# EAGLE design Pitch Converter (EAGLE 6.5.0)
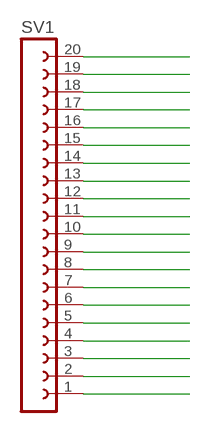
[diagram p0: schematic, sheet 1]

## Parts
SV1  FE20-1  [FE20]

## Nets
N$1: SV1.20
N$8: SV1.19
N$9: SV1.18
N$10: SV1.17
N$11: SV1.16
N$12: SV1.15
N$13: SV1.14
N$14: SV1.13
N$15: SV1.12
N$16: SV1.11
N$17: SV1.10
N$18: SV1.9
N$19: SV1.8
N$20: SV1.7
N$21: SV1.6
N$22: SV1.5
N$23: SV1.4
N$24: SV1.3
N$25: SV1.2
N$26: SV1.1

## Library data of the parts
SV1 = con-lsta:FE20-1: FEMALE HEADER; OC_FARNELL: unknown; OC_NEWARK: unknown

## Board
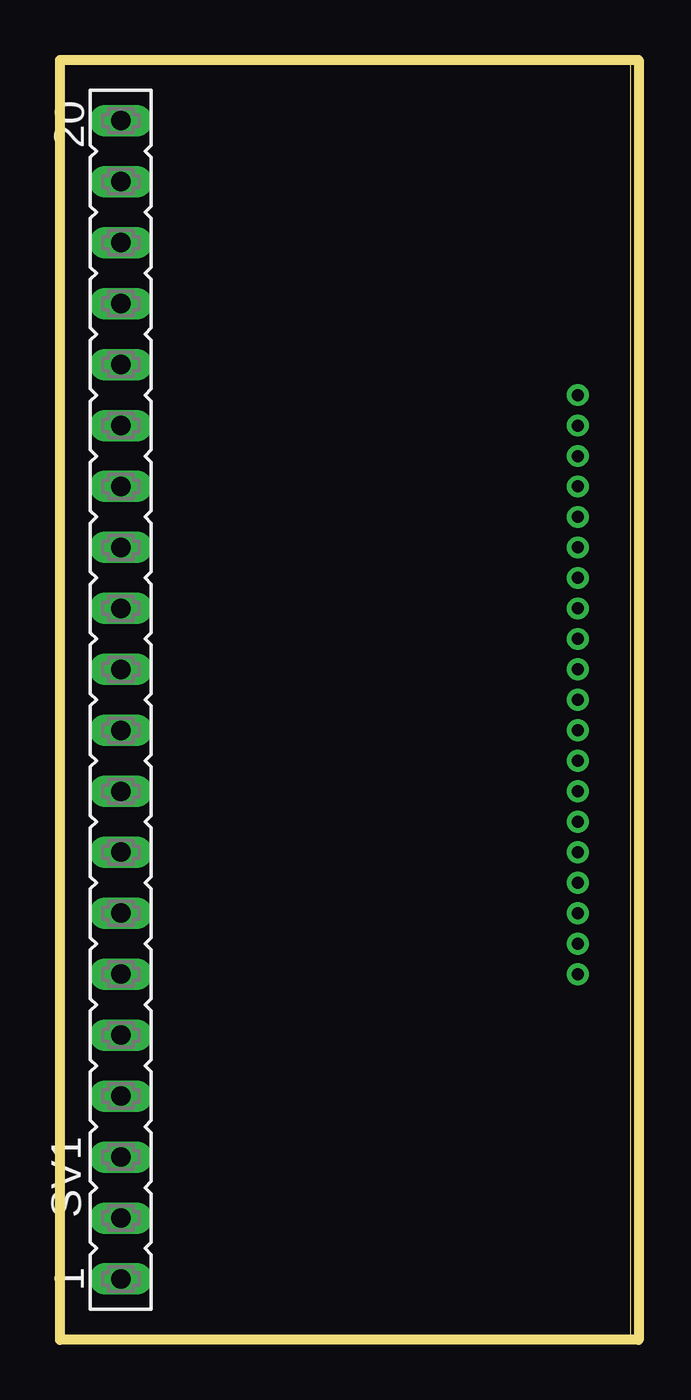
[diagram p1: board, top side]
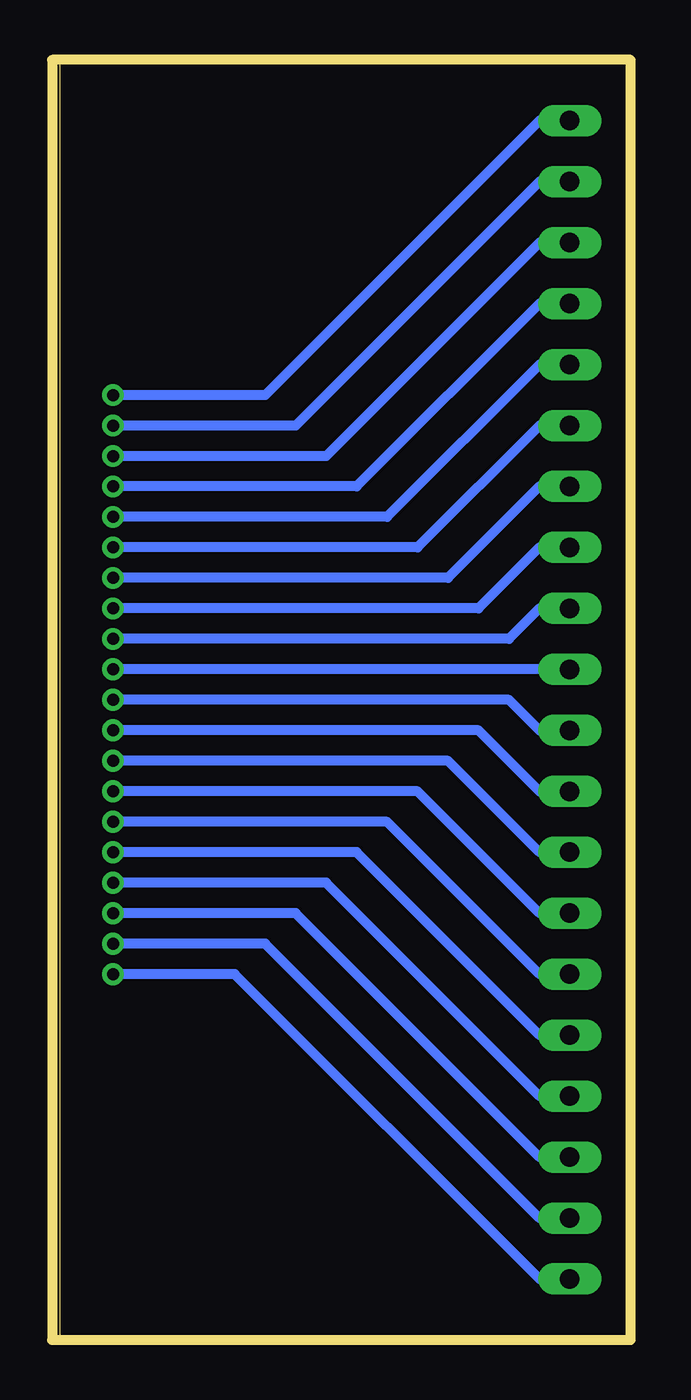
[diagram p2: board, bottom side, seen from below]

Size 23.8 x 53.33 mm. Coordinates in mm from the lower left corner, seen from the top.
Outline: 0,0 23.8,0 23.8,53.33 0,53.33 0,0
Copper layers (1*16): Top 0.035mm / dielectric 1.5mm / Bottom 0.035mm
Design rules "default": minimum track width 10mil, minimum drill 24mil, track to track 8mil, track to pad 8mil, pad to pad 8mil, via to via 8mil, smd to smd 8mil, copper to edge 40mil, drill to drill 8mil, minimum pad ring 10mil, minimum via ring 8mil, stop-mask expansion 4mil, vias tented up to drill 0mil, thermal gap 10mil
Milling: 4 lines

### Footprints (pad centres in the part's own frame; a part is rotated, then mirrored left to right if it is on the bottom)
FE20 = drill 0.813 long: 1 -24.13,0; 2 -21.59,0; 3 -19.05,0; 4 -16.51,0; 5 -13.97,0; 6 -11.43,0; 7 -8.89,0; 8 -6.35,0; 9 -3.81,0; 10 -1.27,0; 11 1.27,0; 12 3.81,0; 13 6.35,0; 14 8.89,0; 15 11.43,0; 16 13.97,0; 17 16.51,0; 18 19.05,0; 19 21.59,0; 20 24.13,0

### Placement (x,y rotation side)
SV1  2.54,26.67 90 top

### Tracks (layer width: path | path; a pad name or v marks a point on that pad's centre or on a via)
N$1  (via drill 0.5 pad 0.25)
  Bottom 0.406: SV1.20 3.81,50.8 15.24,39.37 v21.59,39.37
N$8  (via drill 0.5 pad 0.25)
  Bottom 0.406: SV1.19 3.81,48.26 13.97,38.1 v21.59,38.1
N$9  (via drill 0.5 pad 0.25)
  Bottom 0.406: SV1.18 3.81,45.72 12.7,36.83 v21.59,36.83
N$10  (via drill 0.5 pad 0.25)
  Bottom 0.406: SV1.17 3.81,43.18 11.43,35.56 v21.59,35.56
N$11  (via drill 0.5 pad 0.25)
  Bottom 0.406: SV1.16 3.81,40.64 10.16,34.29 v21.59,34.29
N$12  (via drill 0.5 pad 0.25)
  Bottom 0.406: SV1.15 3.81,38.1 8.89,33.02 v21.59,33.02
N$13  (via drill 0.5 pad 0.25)
  Bottom 0.406: SV1.14 3.81,35.56 7.62,31.75 v21.59,31.75
N$14  (via drill 0.5 pad 0.25)
  Bottom 0.406: SV1.13 3.81,33.02 6.35,30.48 v21.59,30.48
N$15  (via drill 0.5 pad 0.25)
  Bottom 0.406: SV1.12 3.81,30.48 5.08,29.21 v21.59,29.21
N$16  (via drill 0.5 pad 0.25)
  Bottom 0.406: SV1.11 v21.59,27.94
N$17  (via drill 0.5 pad 0.25)
  Bottom 0.406: SV1.10 3.81,25.4 5.08,26.67 v21.59,26.67
N$18  (via drill 0.5 pad 0.25)
  Bottom 0.406: SV1.9 3.81,22.86 6.35,25.4 v21.59,25.4
N$19  (via drill 0.5 pad 0.25)
  Bottom 0.406: SV1.8 3.81,20.32 7.62,24.13 v21.59,24.13
N$20  (via drill 0.5 pad 0.25)
  Bottom 0.406: SV1.7 3.81,17.78 8.89,22.86 v21.59,22.86
N$21  (via drill 0.5 pad 0.25)
  Bottom 0.406: SV1.6 3.81,15.24 10.16,21.59 v21.59,21.59
N$22  (via drill 0.5 pad 0.25)
  Bottom 0.406: SV1.5 3.81,12.7 11.43,20.32 v21.59,20.32
N$23  (via drill 0.5 pad 0.25)
  Bottom 0.406: SV1.4 3.81,10.16 12.7,19.05 v21.59,19.05
N$24  (via drill 0.5 pad 0.25)
  Bottom 0.406: SV1.3 3.81,7.62 13.97,17.78 v21.59,17.78
N$25  (via drill 0.5 pad 0.25)
  Bottom 0.406: SV1.2 3.81,5.08 15.24,16.51 v21.59,16.51
N$26  (via drill 0.5 pad 0.25)
  Bottom 0.406: SV1.1 3.81,2.54 16.51,15.24 v21.59,15.24